# Altium project Main.PrjPCB (part 2 of 2)

## Sheet Resolver.SchDoc
size A4
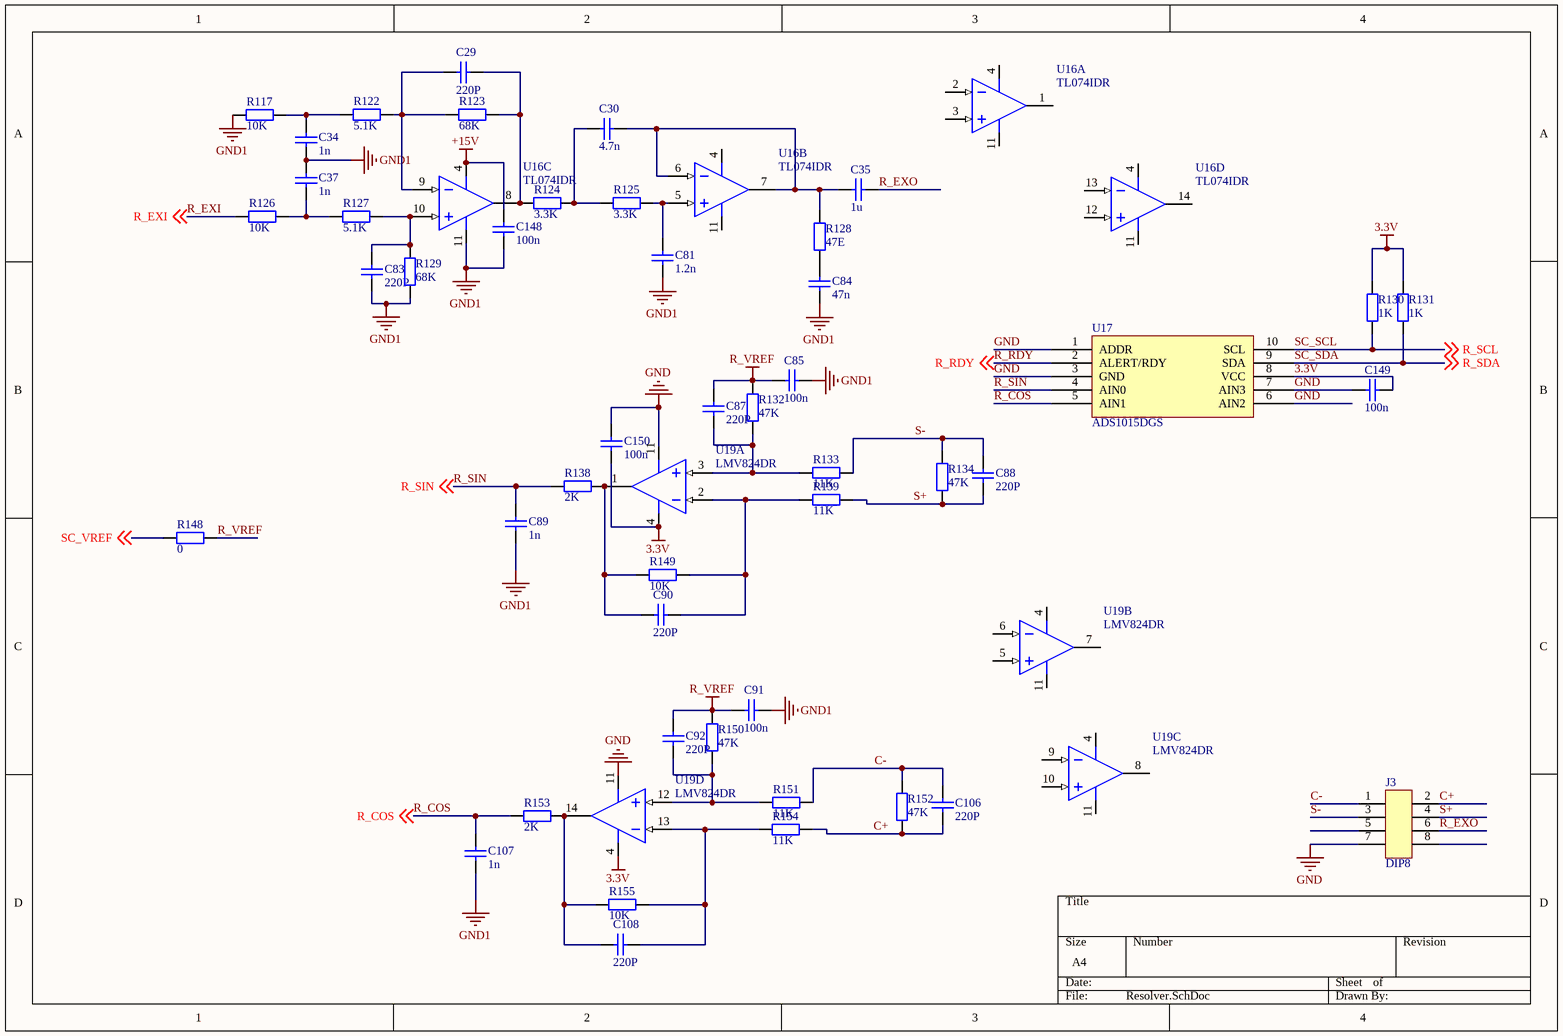
[diagram p7: Resolver.SchDoc]

### Parts
C29  220P  [0603C]
C30  4.7n  [0603C]
C34  1n  [0603C]
C35  1u  [0603C]
C37  1n  [0603C]
C81  1.2n  [0603C]
C83  220P  [0603C]
C84  47n  [0603C]
C85  100n  [0603C]
C87  220P  [0603C]
C88  220P  [0603C]
C89  1n  [0603C]
C90  220P  [0603C]
C91  100n  [0603C]
C92  220P  [0603C]
C106  220P  [0603C]
C107  1n  [0603C]
C108  220P  [0603C]
C148  100n  [0603C]
C149  100n  [0603C]
C150  100n  [0603C]
J3  DIP8  [DIP8-2.54]
R117  10K  [0603R]
R122  5.1K  [0603R]
R123  68K  [0603R]
R124  3.3K  [0603R]
R125  3.3K  [0603R]
R126  10K  [0603R]
R127  5.1K  [0603R]
R128  47E  [0603R]
R129  68K  [0603R]
R130  1K  [0603R]
R131  1K  [0603R]
R132  47K  [0603R]
R133  11K  [0603R]
R134  47K  [0603R]
R138  2K  [0603R]
R139  11K  [0603R]
R148  0  [0603R]
R149  10K  [0603R]
R150  47K  [0603R]
R151  11K  [0603R]
R152  47K  [0603R]
R153  2K  [0603R]
R154  11K  [0603R]
R155  10K  [0603R]
U16  TL074IDR  [SOP-14]  (parts A,B,C,D of 4)
U17  ADS1015DGS  [VSSOP-10]
U19  LMV824DR  [SOP-14]  (parts A,B,C,D of 4)

### Nets
3.3V: C149.2 C150.1 R130.1 R131.1 U17.8(VCC) U19.4(GND)
+15V: C148.2 U16.4(GND)
GND: C149.1 C150.2 J3.7 U17.1(ADDR) U17.3(GND) U17.6(AIN2) U17.7(AIN3) U19.11(V+)
GND1: C34.1 C37.2 C81.1 C83.1 C84.1 C85.1 C89.1 C91.1 C107.1 C148.1 R117.2 R129.2 U16.11(V+)
R_VREF: C85.2 C87.2 C91.2 C92.2 R132.1 R148.1 R150.1
SC_VREF: R148.2 ; off-sheet SC_VREF
C+: C106.2 J3.2 R152.2 R154.1
C-: C106.1 J3.1 R151.1 R152.1
R_COS: C107.2 R153.1 U17.5(AIN1) ; off-sheet R_COS
R_EXI: R126.2 ; off-sheet R_EXI
R_EXO: C35.2 J3.6
R_RDY: U17.2(ALERT/RDY) ; off-sheet R_RDY
R_SIN: C89.2 R138.1 U17.4(AIN0) ; off-sheet R_SIN
S+: C88.2 J3.4 R134.2 R139.1
S-: C88.1 J3.3 R133.1 R134.1
SC_SCL: R130.2 U17.10(SCL) ; off-sheet R_SCL  [also labelled R_SCL]
SC_SDA: R131.2 U17.9(SDA) ; off-sheet R_SDA  [also labelled R_SDA]
NetC29_1: C29.1 R122.1 R123.2 U16.9(IN-)
NetC29_2: C29.2 R123.1 R124.2 U16.8(OUT)
NetC30_1: C30.1 R124.1 R125.2
NetC30_2: C30.2 C35.1 R128.1 U16.6(IN-) U16.7(OUT2)
NetC34_2: C34.2 R117.1 R122.2
NetC37_1: C37.1 R126.1 R127.2
NetC81_2: C81.2 R125.1 U16.5(IN+)
NetC83_2: C83.2 R127.1 R129.1 U16.10(IN+)
NetC84_2: C84.2 R128.2
NetC87_1: C87.1 R132.2 R133.2 U19.3(IN+)
NetC90_1: C90.1 R138.2 R149.1 U19.1(OUT)
NetC90_2: C90.2 R139.2 R149.2 U19.2(IN-)
NetC92_1: C92.1 R150.2 R151.2 U19.12(IN+)
NetC108_1: C108.1 R153.2 R155.1 U19.14(OUT)
NetC108_2: C108.2 R154.2 R155.2 U19.13(IN-)

Not connected (* = marked no-connect by the designer): J3 5 8; U16 1(OUT) 2(IN-) 3(IN+) 12(IN+) 13(IN-) 14(OUT); U19 5(IN+) 6(IN-) 7(OUT2) 8(OUT) 9(IN-) 10(IN+)

### Library data of the parts
C29 C30 C34 C35 C37 C81 C83-C85 C87-C92 C106-C108 C148-C150 = Cap: Capacitor; Value: 100pF; Published: 8-Jun-2000; LatestRevisionDate: 17-Jul-2002; LatestRevisionNote: Re-released for DXP Platform.; PackageReference: RAD-0.3; Publisher: Altium Limited
J3 = DIP8: Connectors; Set Position: 0.5; Published: 8-Jun-2000; LatestRevisionDate: 17-Jul-2002; LatestRevisionNote: Re-released for DXP Platform.; PackageReference: AXIAL-0.6; Publisher: Altium Limited
R117 R122-R129 R132-R134 R138 R139 R148-R155 = Res2: Resistor; Value: 1K; Published: 8-Jun-2000; LatestRevisionDate: 17-Jul-2002; LatestRevisionNote: Re-released for DXP Platform.; PackageReference: AXIAL-0.4; Publisher: Altium Limited
R130 R131 = Res2: Resistor; Published: 8-Jun-2000; LatestRevisionDate: 17-Jul-2002; LatestRevisionNote: Re-released for DXP Platform.; PackageReference: AXIAL-0.4; Publisher: Altium Limited; Value: 1K
U16 U19 = LM339AD: Quad Single-Supply Comparator; Published: 17-Jul-2002; LatestRevisionDate: 13-Apr-2006; LatestRevisionNote: IPC-7351 Footprint Added.; DatasheetVersion: 1988; PackageVersion: 1991; PackageReference: 751A-02; Publisher: Altium Limited; PackageDescription: 14-Pin Small Outline Integrated Circuit 1.27 mm Pitch; Code_IPC: SOIC127P600-14; ComponentLink1Description: Manufacturer Link; ComponentLink1URL: http://www.onsemi.com/site/products/taxonomy/0,4438,133,00.html
U17 = ADS1015

## Sheet EtherCAT.SchDoc
size A4
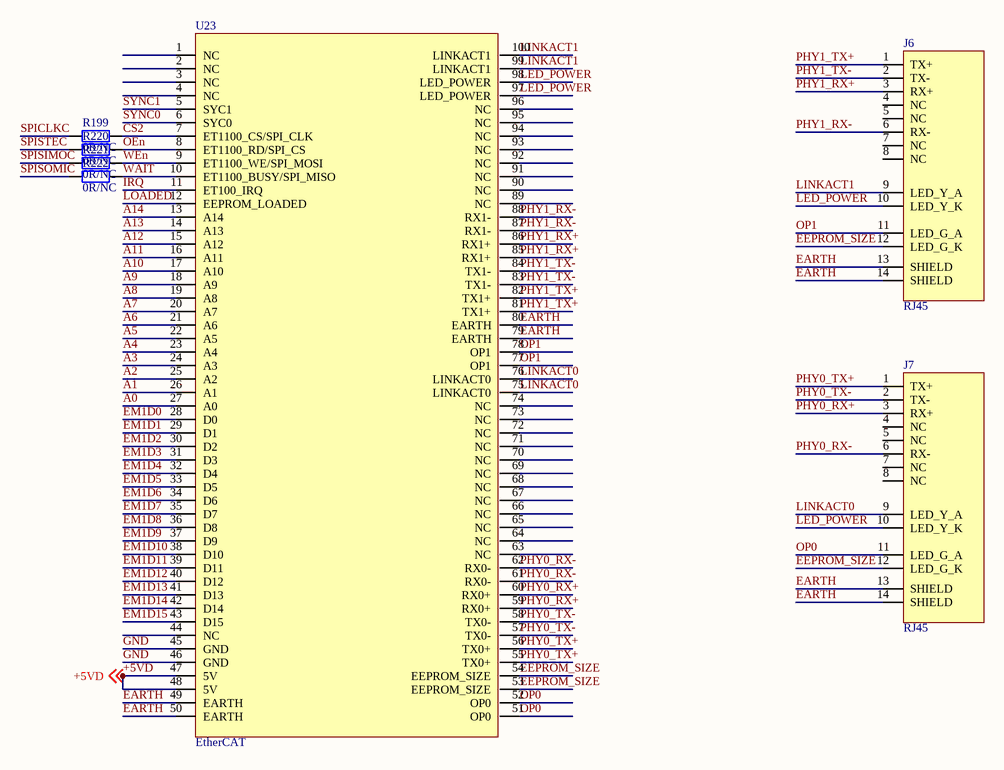
[diagram p8: EtherCAT.SchDoc]

### Parts
J6  RJ45  [RJ45]
J7  RJ45  [RJ45]
R199  0R/NC  [0603R]
R220  0R/NC  [0603R]
R221  0R/NC  [0603R]
R222  0R/NC  [0603R]
U23  EtherCAT  [EtherCAT]

### Nets
+5VD: U23.47(5V) U23.48(5V) ; off-sheet +5VD
EARTH: J6.13(SHIELD) J6.14(SHIELD) J7.13(SHIELD) J7.14(SHIELD) U23.49(EARTH) U23.50(EARTH) U23.79(EARTH) U23.80(EARTH)
GND: U23.45(GND) U23.46(GND)
A0: U23.27(A0)
A1: U23.26(A1)
A2: U23.25(A2)
A3: U23.24(A3)
A4: U23.23(A4)
A5: U23.22(A5)
A6: U23.21(A6)
A7: U23.20(A7)
A8: U23.19(A8)
A9: U23.18(A9)
A10: U23.17(A10)
A11: U23.16(A11)
A12: U23.15(A12)
A13: U23.14(A13)
A14: U23.13(A14)
CS2: R199.1 U23.7(ET1100_CS/SPI_CLK)
EEPROM_SIZE: J6.12(LED_G_K) J7.12(LED_G_K) U23.53(EEPROM_SIZE) U23.54(EEPROM_SIZE)
EM1D0: U23.28(D0)
EM1D1: U23.29(D1)
EM1D2: U23.30(D2)
EM1D3: U23.31(D3)
EM1D4: U23.32(D4)
EM1D5: U23.33(D5)
EM1D6: U23.34(D6)
EM1D7: U23.35(D7)
EM1D8: U23.36(D8)
EM1D9: U23.37(D9)
EM1D10: U23.38(D10)
EM1D11: U23.39(D11)
EM1D12: U23.40(D12)
EM1D13: U23.41(D13)
EM1D14: U23.42(D14)
EM1D15: U23.43(D15)
IRQ: U23.11(ET100_IRQ)
LED_POWER: J6.10(LED_Y_K) J7.10(LED_Y_K) U23.97(LED_POWER) U23.98(LED_POWER)
LINKACT0: J7.9(LED_Y_A) U23.75(LINKACT0) U23.76(LINKACT0)
LINKACT1: J6.9(LED_Y_A) U23.99(LINKACT1) U23.100(LINKACT1)
LOADED: U23.12(EEPROM_LOADED)
OEn: R220.1 U23.8(ET1100_RD/SPI_CS)
OP0: J7.11(LED_G_A) U23.51(OP0) U23.52(OP0)
OP1: J6.11(LED_G_A) U23.77(OP1) U23.78(OP1)
PHY0_RX+: J7.3(RX+) U23.59(RX0+) U23.60(RX0+)
PHY0_RX-: J7.6(RX-) U23.61(RX0-) U23.62(RX0-)
PHY0_TX+: J7.1(TX+) U23.55(TX0+) U23.56(TX0+)
PHY0_TX-: J7.2(TX-) U23.57(TX0-) U23.58(TX0-)
PHY1_RX+: J6.3(RX+) U23.85(RX1+) U23.86(RX1+)
PHY1_RX-: J6.6(RX-) U23.87(RX1-) U23.88(RX1-)
PHY1_TX+: J6.1(TX+) U23.81(TX1+) U23.82(TX1+)
PHY1_TX-: J6.2(TX-) U23.83(TX1-) U23.84(TX1-)
SPICLKC: R199.2
SPISIMOC: R221.2
SPISOMIC: R222.2
SPISTEC: R220.2
SYNC0: U23.6(SYC0)
SYNC1: U23.5(SYC1)
WAIT: R222.1 U23.10(ET1100_BUSY/SPI_MISO)
WEn: R221.1 U23.9(ET1100_WE/SPI_MOSI)

Not connected (* = marked no-connect by the designer): J6 4(NC) 5(NC) 7(NC) 8(NC); J7 4(NC) 5(NC) 7(NC) 8(NC); U23 1(NC) 2(NC) 3(NC) 4(NC) 44(NC) 63(NC) 64(NC) 65(NC) 66(NC) 67(NC) 68(NC) 69(NC) 70(NC) 71(NC) 72(NC) 73(NC) 74(NC) 89(NC) 90(NC) 91(NC) 92(NC) 93(NC) 94(NC) 95(NC) 96(NC)

### Library data of the parts
R199 R220-R222 = Res2: Resistor; Value: 1K; Published: 8-Jun-2000; LatestRevisionDate: 17-Jul-2002; LatestRevisionNote: Re-released for DXP Platform.; PackageReference: AXIAL-0.4; Publisher: Altium Limited
U23 = EtherCAT_MOD

## Nets that join several sheets
1.2VD: Main-C (7 pins), DSP-Core (12 pins)
1.5V: Main-C (8 pins), DSP-Core (U1.42)
3.3V: Main-C (19 pins), DSP-Core (62 pins), EnDat-Biss (C144.1 U12.2 U12.8), SinCos (7 pins), Resolver (6 pins)
+5VD: Main-C (43 pins), DSP-Core (C25.1 C26.1 U7.1 U22.5), EnDat-Biss (10 pins), SinCos (C155.2 J4.7), EtherCAT (U23.47 U23.48)
+15V: Main-C (9 pins), Resolver (C148.2 U16.4)
EARTH: Main-C (9 pins), EtherCAT (8 pins)
GND: Main-C (185 pins), DSP-Core (58 pins), EnDat-Biss (9 pins), SinCos (10 pins), Resolver (8 pins), EtherCAT (U23.45 U23.46)
GND1: Main-C (45 pins), DSP-Core (22 pins), Resolver (13 pins)
SC_VREF: SinCos (5 pins), Resolver (R148.2)
VDDA1: Main-C (8 pins), DSP-Core (10 pins)
A0: DSP-Core (U1.175), EtherCAT (U23.27)
A1: DSP-Core (U1.174), EtherCAT (U23.26)
A2: DSP-Core (U1.85), EtherCAT (U23.25)
A3: DSP-Core (U1.86), EtherCAT (U23.24)
A4: DSP-Core (U1.87), EtherCAT (U23.23)
A5: DSP-Core (U1.89), EtherCAT (U23.22)
A6: DSP-Core (U1.113), EtherCAT (U23.21)
A7: DSP-Core (U1.115), EtherCAT (U23.20)
A8: DSP-Core (U1.128), EtherCAT (U23.19)
A9: DSP-Core (U1.129), EtherCAT (U23.18)
A10: DSP-Core (U1.90), EtherCAT (U23.17)
A11: DSP-Core (U1.93), EtherCAT (U23.16)
A12: DSP-Core (R140.1 U1.94), EtherCAT (U23.15)
A13: DSP-Core (R197.1 U1.95), EtherCAT (U23.14)
A14: DSP-Core (R198.1 U1.96), EtherCAT (U23.13)
CPLD_SCLA: Main-C (U2.71), DSP-Core (U1.69)
CPLD_SDAA: Main-C (U2.62), DSP-Core (U1.67)
CS2: DSP-Core (U1.70), EtherCAT (R199.1 U23.7)
DONE: Main-C (R47.1 U2.54), DSP-Core (U1.104)
DSP_CE: Main-C (R93.2 U116.2), DSP-Core (U1.19)
DSP_SCK: Main-C (R94.2 U116.4), DSP-Core (U1.10)
DSP_SI: Main-C (R119.1 U116.9), DSP-Core (U1.8)
EEPROM_/CS: Main-C (R46.2 U18.1), DSP-Core (U1.71)
EM1D0: DSP-Core (U1.155), EtherCAT (U23.28)
EM1D1: DSP-Core (U1.151), EtherCAT (U23.29)
EM1D2: DSP-Core (U1.150), EtherCAT (U23.30)
EM1D3: DSP-Core (U1.149), EtherCAT (U23.31)
EM1D4: DSP-Core (U1.148), EtherCAT (U23.32)
EM1D5: DSP-Core (U1.146), EtherCAT (U23.33)
EM1D6: DSP-Core (U1.145), EtherCAT (U23.34)
EM1D7: DSP-Core (U1.144), EtherCAT (U23.35)
EM1D8: DSP-Core (U1.143), EtherCAT (U23.36)
EM1D9: DSP-Core (U1.142), EtherCAT (U23.37)
EM1D10: DSP-Core (U1.141), EtherCAT (U23.38)
EM1D11: DSP-Core (U1.140), EtherCAT (U23.39)
EM1D12: DSP-Core (R111.2 R112.1 U1.139), EtherCAT (U23.40)
EM1D13: DSP-Core (U1.136), EtherCAT (U23.41)
EM1D14: DSP-Core (U1.135), EtherCAT (U23.42)
EM1D15: DSP-Core (U1.134), EtherCAT (U23.43)
EN_485: Main-C (R33.1 U79.2 U79.3), DSP-Core (U1.2)
EN_TRG: Main-C (U2.52), DSP-Core (U1.103)
ENC_CLK: Main-C (U2.35), DSP-Core (R41.2), EnDat-Biss (U12.5)
ENC_DI: Main-C (U2.32 U2.33), DSP-Core (R38.1 R42.1), EnDat-Biss (U12.1 U12.3)
ENC_TXEN: Main-C (U2.34), DSP-Core (R57.1), EnDat-Biss (U12.4)
EXT_DIR_ALTA: Main-C (U2.72), DSP-Core (U1.107)
EXT_PS_ALTA: Main-C (U2.73), DSP-Core (U1.105)
IRQ: DSP-Core (U1.98), EtherCAT (U23.11)
L_V1: Main-C (D56.3 R326.2), DSP-Core (C8.2 U1.38)
L_V2: Main-C (D55.3 R325.2), DSP-Core (C36.2 U1.41)
L_W1: Main-C (D57.3 R327.2), DSP-Core (C44.2 U1.40)
L_W2: Main-C (D54.3 R324.2), DSP-Core (C65.2 U1.39)
LOADED: DSP-Core (U1.100), EtherCAT (U23.12)
MON: Main-C (R213.2 R219.2), DSP-Core (U1.112)
OC: Main-C (U59.4), DSP-Core (U1.5)
OEn: DSP-Core (U1.84), EtherCAT (R220.1 U23.8)
PROG_B: Main-C (U2.100), DSP-Core (R76.2 R194.2)
PWM_B#: Main-C (R75.1 U78.2), DSP-Core (U1.166)
PWM_U: Main-C (R10.2 U11.5), DSP-Core (U1.161)
PWM_U#: Main-C (R5.2 U11.11), DSP-Core (U1.160)
PWM_V: Main-C (R9.2 U11.3), DSP-Core (U1.163)
PWM_V#: Main-C (R7.2 U11.9), DSP-Core (U1.162)
PWM_W: Main-C (R8.2 U11.1), DSP-Core (U1.165)
PWM_W#: Main-C (R6.2 U11.13), DSP-Core (U1.164)
R_COS: DSP-Core (U1.57), Resolver (C107.2 R153.1 U17.5)
R_EXI: Main-C (U2.13), DSP-Core (R72.2), Resolver (R126.2)
R_RDY: Main-C (U2.28), Resolver (U17.2)
R_SIN: DSP-Core (U1.56), Resolver (C89.2 R138.1 U17.4)
RELAY: Main-C (CN5.17), DSP-Core (R196.1)
RESET_CONA: Main-C (C98.2 R137.2 U2.68 U102.4), DSP-Core (U1.124)
SC_A: DSP-Core (U1.31), SinCos (C109.1 R176.1 U20.1 U21.4)
SC_B: DSP-Core (U1.30), SinCos (C110.1 R183.1 U20.7 U21.5)
SC_R: DSP-Core (U1.29), SinCos (C111.1 R190.1 U20.8 U21.6)
SC_RDY: Main-C (U2.15), SinCos (U21.2)
SC_SCL: Main-C (U2.19 U2.37), SinCos (R181.2 U21.10), Resolver (R130.2 U17.10)
SC_SDA: Main-C (U2.20 U2.36), SinCos (R182.2 U21.9), Resolver (R131.2 U17.9)
SO: Main-C (U2.51 U116.11), DSP-Core (U1.9)
SPEED1: Main-C (C255.1 D61.3 R329.1), DSP-Core (U1.47)
SPEED2: Main-C (C254.2 D59.3 R328.1), DSP-Core (U1.48)
SPEED_O: Main-C (R207.1 R217.2), DSP-Core (U1.18)
SPICLKB: Main-C (U2.59), DSP-Core (U1.27)
SPICLKC: DSP-Core (R198.2), EtherCAT (R199.2)
SPISIMOB: Main-C (U2.56), DSP-Core (U1.24)
SPISIMOC: DSP-Core (R140.2), EtherCAT (R221.2)
SPISOMIB: Main-C (U2.48), DSP-Core (U1.25)
SPISOMIC: DSP-Core (R197.2), EtherCAT (R222.2)
SPISTEB: Main-C (U2.83), DSP-Core (U1.28)
SPISTEC: DSP-Core (U1.97), EtherCAT (R220.2)
SYNC0: DSP-Core (U1.171), EtherCAT (U23.6)
SYNC1: DSP-Core (U1.172), EtherCAT (U23.5)
TEMP: Main-C (CN5.1), DSP-Core (C82.1 R406.2 U1.49)
TORQUE: Main-C (C256.1 D62.3 R330.1), DSP-Core (U1.46)
TORQUE_O: Main-C (R201.1 R218.2), DSP-Core (U1.1)
URXD_232: Main-C (R419.2), DSP-Core (C73.1 U1.64)
URXD_485: Main-C (R417.1), DSP-Core (C113.1 U1.23)
UTXD_232: Main-C (U51.11), DSP-Core (R70.1 U1.65)
UTXD_485: Main-C (U79.4), DSP-Core (R193.1 U1.22)
V_DET: Main-C (D51.3 R323.2), DSP-Core (C66.1 U1.43)
WAIT: DSP-Core (U1.83), EtherCAT (R222.1 U23.10)
WEn: DSP-Core (U1.66), EtherCAT (R221.1 U23.9)
XCLKIN: Main-C (U33.6), DSP-Core (R78.1)